# Altium project distribution amp.prjpcb
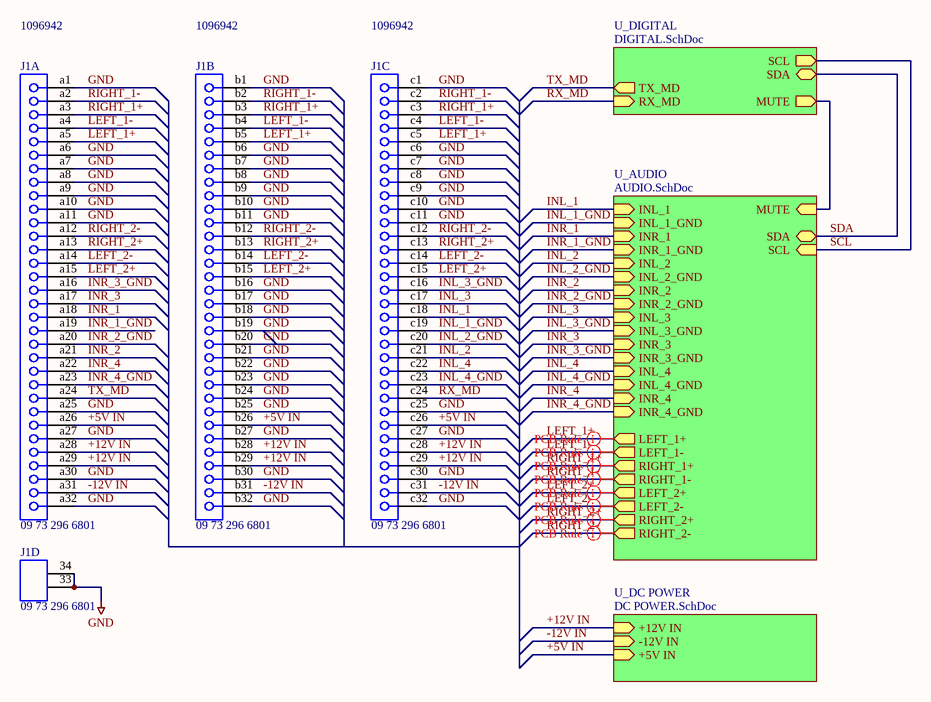
[diagram p0: Distribution Amp.SchDoc]
4 sheets, 136 parts. Net scope: hierarchical (ports join the sheet entries above them; power ports are global).
Board files: Distribution Amp (Seeed).PcbDoc, TDA1552 fix.PcbDoc
Sheets:
  Distribution Amp.SchDoc
    U_AUDIO = AUDIO.SchDoc
    U_DC POWER = DC POWER.SchDoc
    U_DIGITAL = DIGITAL.SchDoc

## Sheet Distribution Amp.SchDoc
size A3

### Parts
J1  09 73 296 6801  Supplier Part Number 3: 1096942  [0973296X801]  (parts A,B,C,D of 4)

### Sub-sheets
U_AUDIO = AUDIO.SchDoc: LEFT_1+ (out), LEFT_1- (out), RIGHT_1+ (out), RIGHT_1- (out), LEFT_2+ (out), LEFT_2- (out), RIGHT_2+ (out), RIGHT_2- (out), MUTE (in), INL_1 (in), INR_1 (in), INR_2 (in), INL_2 (in), INL_3 (in), INR_3 (in), INL_4 (in), INR_4 (in), SCL (in), SDA (bidir), INL_1_GND (in), INR_1_GND (in), INL_2_GND (in), INR_2_GND (in), INR_4_GND (in), INL_4_GND (in), INR_3_GND (in), INL_3_GND (in)
U_DC POWER = DC POWER.SchDoc: +12V IN (in), -12V IN (in), +5V IN (in)
U_DIGITAL = DIGITAL.SchDoc: SDA (bidir), SCL (out), MUTE (out), TX_MD (out), RX_MD (in)

### Nets
GND: J1.33(MH1) J1.34(MH2) J1.a1 J1.a6 J1.a7 J1.a8 J1.a9 J1.a10 J1.a11 J1.a25 J1.a27 J1.a30 J1.a32 J1.b1 J1.b6 J1.b7 J1.b8 J1.b9 J1.b10 J1.b11 J1.b16 J1.b17 J1.b18 J1.b19 J1.b20 J1.b21 J1.b22 J1.b23 J1.b24 J1.b25 J1.b27 J1.b30 J1.b32 J1.c1 J1.c6 J1.c7 J1.c8 J1.c9 J1.c10 J1.c11 J1.c25 J1.c27 J1.c30 J1.c32
+5V IN: J1.a26 J1.b26 J1.c26 ; sheet U_DC POWER/+5V IN
+12V IN: J1.a28 J1.a29 J1.b28 J1.b29 J1.c28 J1.c29 ; sheet U_DC POWER/+12V IN
-12V IN: J1.a31 J1.b31 J1.c31 ; sheet U_DC POWER/-12V IN
INL_1: J1.c18 ; sheet U_AUDIO/INL_1
INL_1_GND: J1.c19 ; sheet U_AUDIO/INL_1_GND
INL_2: J1.c21 ; sheet U_AUDIO/INL_2
INL_2_GND: J1.c20 ; sheet U_AUDIO/INL_2_GND
INL_3: J1.c17 ; sheet U_AUDIO/INL_3
INL_3_GND: J1.c16 ; sheet U_AUDIO/INL_3_GND
INL_4: J1.c22 ; sheet U_AUDIO/INL_4
INL_4_GND: J1.c23 ; sheet U_AUDIO/INL_4_GND
INR_1: J1.a18 ; sheet U_AUDIO/INR_1
INR_1_GND: J1.a19 ; sheet U_AUDIO/INR_1_GND
INR_2: J1.a21 ; sheet U_AUDIO/INR_2
INR_2_GND: J1.a20 ; sheet U_AUDIO/INR_2_GND
INR_3: J1.a17 ; sheet U_AUDIO/INR_3
INR_3_GND: J1.a16 ; sheet U_AUDIO/INR_3_GND
INR_4: J1.a22 ; sheet U_AUDIO/INR_4
INR_4_GND: J1.a23 ; sheet U_AUDIO/INR_4_GND
LEFT_1+: J1.a5 J1.b5 J1.c5 ; sheet U_AUDIO/LEFT_1+
LEFT_1-: J1.a4 J1.b4 J1.c4 ; sheet U_AUDIO/LEFT_1-
LEFT_2+: J1.a15 J1.b15 J1.c15 ; sheet U_AUDIO/LEFT_2+
LEFT_2-: J1.a14 J1.b14 J1.c14 ; sheet U_AUDIO/LEFT_2-
MUTE: sheet U_AUDIO/MUTE, sheet U_DIGITAL/MUTE
RIGHT_1+: J1.a3 J1.b3 J1.c3 ; sheet U_AUDIO/RIGHT_1+
RIGHT_1-: J1.a2 J1.b2 J1.c2 ; sheet U_AUDIO/RIGHT_1-
RIGHT_2+: J1.a13 J1.b13 J1.c13 ; sheet U_AUDIO/RIGHT_2+
RIGHT_2-: J1.a12 J1.b12 J1.c12 ; sheet U_AUDIO/RIGHT_2-
RX_MD: J1.c24 ; sheet U_DIGITAL/RX_MD
SCL: sheet U_AUDIO/SCL, sheet U_DIGITAL/SCL
SDA: sheet U_AUDIO/SDA, sheet U_DIGITAL/SDA
TX_MD: J1.a24 ; sheet U_DIGITAL/TX_MD

### Layout directives
rule Undefined; rule Width Constraint [Pref Width = 25mil    Min Width = 15mil    Max Width = 250mil]: LEFT_1+, LEFT_1-, LEFT_2+, LEFT_2-, RIGHT_1+, RIGHT_1-, RIGHT_2+, RIGHT_2-

### Library data of the parts
J1 = 09 73 296 6801: Eurocard DIN 41612, Type R, 96 Position, Rows a+b+c, Performance level 2, Female, Lead 3.0 mm, Pitch 2.54 mm; Manufacturer: HARTING; Manufacturer Part No.: 09732966801; Mouser Part no.: 617-09-73-296-6801; Value: 09732966801; Web link: http://au.mouser.com/ProductDetail/HARTING/09732966801/?qs=qa49y27LPCFbWAgQmjjqsljhIHhtEdU7BdVlYk8VXic%3d; Supplier 1: Mouser; Supplier Part Number 1: 617-09-73-296-6801; Supplier 2: Digi-Key; Supplier Part Number 2: 1195-2893-ND; Supplier 3: Farnell

## Sheet AUDIO.SchDoc
size A3
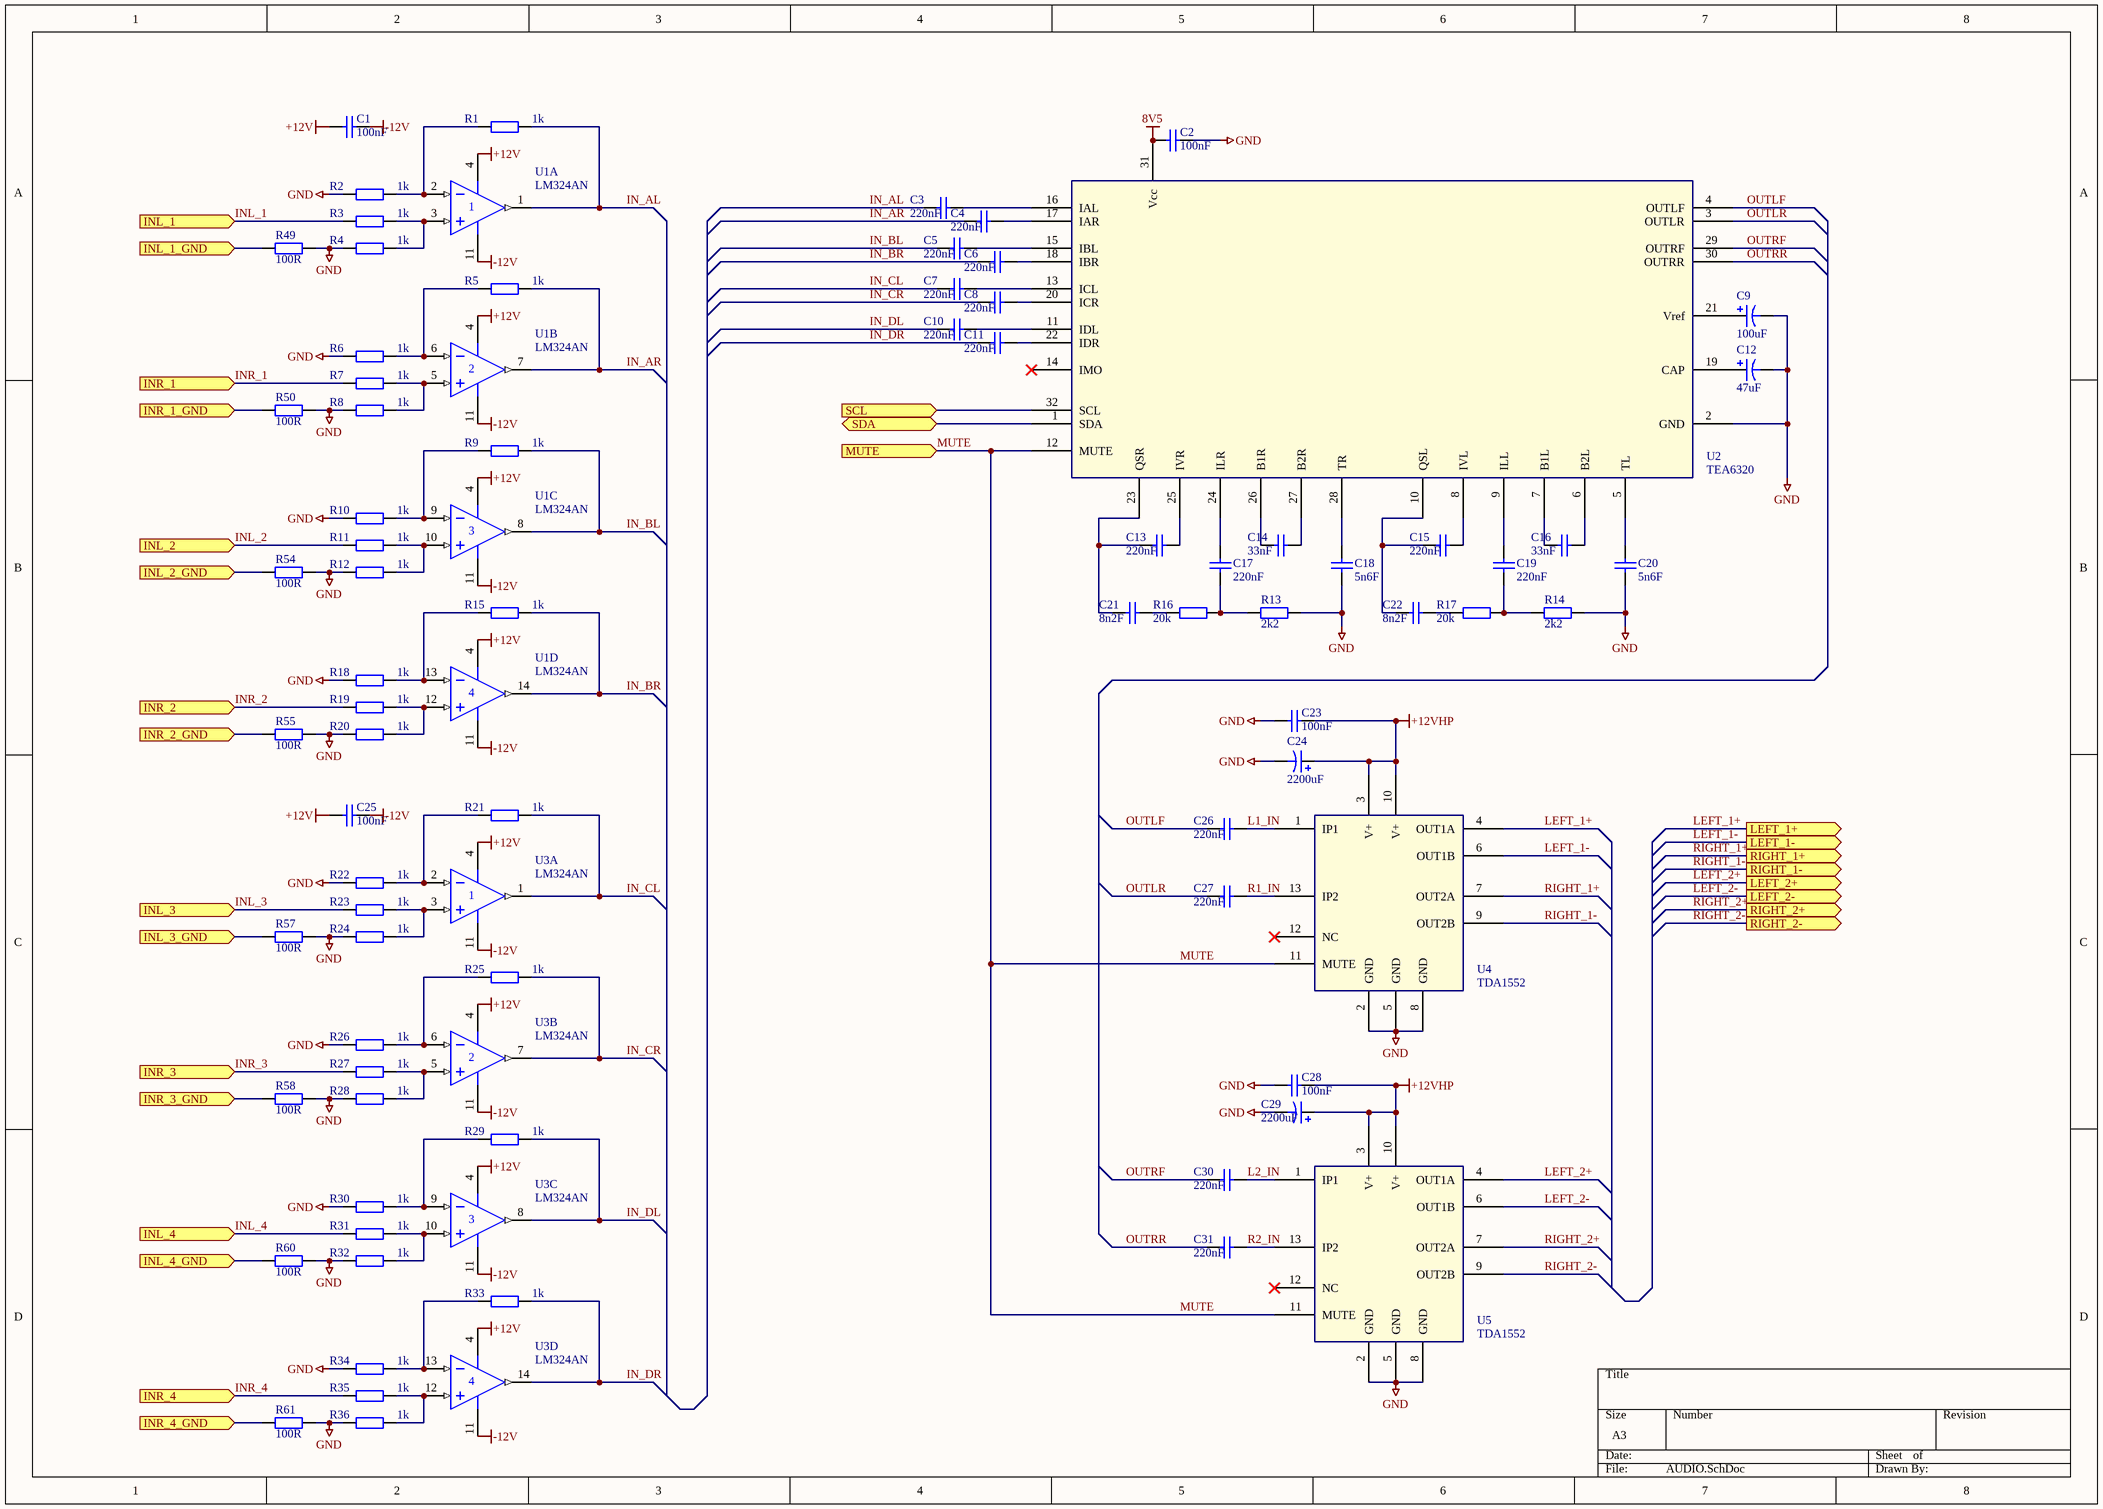
[diagram p1: AUDIO.SchDoc]

### Parts
C1  100nF  [CAP (3D) - 0603]
C2  100nF  [CAP (3D) - 0603]
C3  220nF  [CAP (3D) - 0603]
C4  220nF  [CAP (3D) - 0603]
C5  220nF  [CAP (3D) - 0603]
C6  220nF  [CAP (3D) - 0603]
C7  220nF  [CAP (3D) - 0603]
C8  220nF  [CAP (3D) - 0603]
C9  100uF  [CAPPR5-5x5]
C10  220nF  [CAP (3D) - 0603]
C11  220nF  [CAP (3D) - 0603]
C12  47uF  [CAPPR5-5x5]
C13  220nF  [CAP (3D) - 0603]
C14  33nF  [CAP (3D) - 0603]
C15  220nF  [CAP (3D) - 0603]
C16  33nF  [CAP (3D) - 0603]
C17  220nF  [CAP (3D) - 0603]
C18  5n6F  [CAP (3D) - 0603]
C19  220nF  [CAP (3D) - 0603]
C20  5n6F  [CAP (3D) - 0603]
C21  8n2F  [CAP (3D) - 0603]
C22  8n2F  [CAP (3D) - 0603]
C23  100nF  [CAP (3D) - 0603]
C24  2200uF  [CAPPR7.5-16x35]
C25  100nF  [CAP (3D) - 0603]
C26  220nF  [CAP (3D) - 0603]
C27  220nF  [CAP (3D) - 0603]
C28  100nF  [CAP (3D) - 0603]
C29  2200uF  [CAPPR7.5-16x35]
C30  220nF  [CAP (3D) - 0603]
C31  220nF  [CAP (3D) - 0603]
R1  1k  [RES (3D) - 0603]
R2  1k  [RES (3D) - 0603]
R3  1k  [RES (3D) - 0603]
R4  1k  [RES (3D) - 0603]
R5  1k  [RES (3D) - 0603]
R6  1k  [RES (3D) - 0603]
R7  1k  [RES (3D) - 0603]
R8  1k  [RES (3D) - 0603]
R9  1k  [RES (3D) - 0603]
R10  1k  [RES (3D) - 0603]
R11  1k  [RES (3D) - 0603]
R12  1k  [RES (3D) - 0603]
R13  2k2  [RES (3D) - 0603]
R14  2k2  [RES (3D) - 0603]
R15  1k  [RES (3D) - 0603]
R16  20k  [RES (3D) - 0603]
R17  20k  [RES (3D) - 0603]
R18  1k  [RES (3D) - 0603]
R19  1k  [RES (3D) - 0603]
R20  1k  [RES (3D) - 0603]
R21  1k  [RES (3D) - 0603]
R22  1k  [RES (3D) - 0603]
R23  1k  [RES (3D) - 0603]
R24  1k  [RES (3D) - 0603]
R25  1k  [RES (3D) - 0603]
R26  1k  [RES (3D) - 0603]
R27  1k  [RES (3D) - 0603]
R28  1k  [RES (3D) - 0603]
R29  1k  [RES (3D) - 0603]
R30  1k  [RES (3D) - 0603]
R31  1k  [RES (3D) - 0603]
R32  1k  [RES (3D) - 0603]
R33  1k  [RES (3D) - 0603]
R34  1k  [RES (3D) - 0603]
R35  1k  [RES (3D) - 0603]
R36  1k  [RES (3D) - 0603]
R49  100R  [RES (3D) - 0603]
R50  100R  [RES (3D) - 0603]
R54  100R  [RES (3D) - 0603]
R55  100R  [RES (3D) - 0603]
R57  100R  [RES (3D) - 0603]
R58  100R  [RES (3D) - 0603]
R60  100R  [RES (3D) - 0603]
R61  100R  [RES (3D) - 0603]
U1  LM324AN  [N014]  (parts A,B,C,D of 4)
U2  TEA6320  [SOIC127P1047-32L]
U3  LM324AN  [N014]  (parts A,B,C,D of 4)
U4  TDA1552  [DBS13P]
U5  TDA1552  [DBS13P]

### Ports
INL_1 (in), INL_1_GND (in), INL_2 (in), INL_2_GND (in), INL_3 (in), INL_3_GND (in), INL_4 (in), INL_4_GND (in), INR_1 (in), INR_1_GND (in), INR_2 (in), INR_2_GND (in), INR_3 (in), INR_3_GND (in), INR_4 (in), INR_4_GND (in), LEFT_1+ (out), LEFT_1- (out), LEFT_2+ (out), LEFT_2- (out), MUTE (in), RIGHT_1+ (out), RIGHT_1- (out), RIGHT_2+ (out), RIGHT_2- (out), SCL (in), SDA (bidir)

### Nets
8V5: C2.1 U2.31(Vcc)
+12V: C1.1 C25.1 U1.4(V+) U3.4(V+)
+12VHP: C23.2 C24.1 C28.2 C29.1 U4.3(V+) U4.10(V+) U5.3(V+) U5.10(V+)
-12V: C1.2 C25.2 U1.11(V-) U3.11(V-)
GND: C2.2 C9.2 C12.2 C18.2 C20.2 C23.1 C24.2 C28.1 C29.2 R2.1 R4.1 R6.1 R8.1 R10.1 R12.1 R13.2 R14.2 R18.1 R20.1 R22.1 R24.1 R26.1 R28.1 R30.1 R32.1 R34.1 R36.1 R49.2 R50.2 R54.2 R55.2 R57.2 R58.2 R60.2 R61.2 U2.2(GND) U4.2(GND) U4.5(GND) U4.8(GND) U5.2(GND) U5.5(GND) U5.8(GND)
IN_AL: C3.1 R1.2 U1.1(OUT)
IN_AR: C4.1 R5.2 U1.7(OUT)
IN_BL: C5.1 R9.2 U1.8(OUT)
IN_BR: C6.1 R15.2 U1.14(OUT)
IN_CL: C7.1 R21.2 U3.1(OUT)
IN_CR: C8.1 R25.2 U3.7(OUT)
IN_DL: C10.1 R29.2 U3.8(OUT)
IN_DR: C11.1 R33.2 U3.14(OUT)
INL_1: R3.1 ; port INL_1
INL_1_GND: R49.1 ; port INL_1_GND
INL_2: R11.1 ; port INL_2
INL_2_GND: R54.1 ; port INL_2_GND
INL_3: R23.1 ; port INL_3
INL_3_GND: R57.1 ; port INL_3_GND
INL_4: R31.1 ; port INL_4
INL_4_GND: R60.1 ; port INL_4_GND
INR_1: R7.1 ; port INR_1
INR_1_GND: R50.1 ; port INR_1_GND
INR_2: R19.1 ; port INR_2
INR_2_GND: R55.1 ; port INR_2_GND
INR_3: R27.1 ; port INR_3
INR_3_GND: R58.1 ; port INR_3_GND
INR_4: R35.1 ; port INR_4
INR_4_GND: R61.1 ; port INR_4_GND
L1_IN: C26.2 U4.1(IP1)
L2_IN: C30.2 U5.1(IP1)
LEFT_1+: U4.4(OUT1A) ; port LEFT_1+
LEFT_1-: U4.6(OUT1B) ; port LEFT_1-
LEFT_2+: U5.4(OUT1A) ; port LEFT_2+
LEFT_2-: U5.6(OUT1B) ; port LEFT_2-
MUTE: U2.12(MUTE) U4.11(MUTE) U5.11(MUTE) ; port MUTE
OUTLF: C26.1 U2.4(OUTLF)
OUTLR: C27.1 U2.3(OUTLR)
OUTRF: C30.1 U2.29(OUTRF)
OUTRR: C31.1 U2.30(OUTRR)
R1_IN: C27.2 U4.13(IP2)
R2_IN: C31.2 U5.13(IP2)
RIGHT_1+: U4.7(OUT2A) ; port RIGHT_1+
RIGHT_1-: U4.9(OUT2B) ; port RIGHT_1-
RIGHT_2+: U5.7(OUT2A) ; port RIGHT_2+
RIGHT_2-: U5.9(OUT2B) ; port RIGHT_2-
SCL: U2.32(SCL) ; port SCL
SDA: U2.1(SDA) ; port SDA
NetC3_2: C3.2 U2.16(IAL)
NetC4_2: C4.2 U2.17(IAR)
NetC5_2: C5.2 U2.15(IBL)
NetC6_2: C6.2 U2.18(IBR)
NetC7_2: C7.2 U2.13(ICL)
NetC8_2: C8.2 U2.20(ICR)
NetC9_1: C9.1 U2.21(Vref)
NetC10_2: C10.2 U2.11(IDL)
NetC11_2: C11.2 U2.22(IDR)
NetC12_1: C12.1 U2.19(CAP)
NetC13_1: C13.1 C21.1 U2.23(QSR)
NetC13_2: C13.2 U2.25(IVR)
NetC14_1: C14.1 U2.26(B1R)
NetC14_2: C14.2 U2.27(B2R)
NetC15_1: C15.1 C22.1 U2.10(QSL)
NetC15_2: C15.2 U2.8(IVL)
NetC16_1: C16.1 U2.7(B1L)
NetC16_2: C16.2 U2.6(B2L)
NetC17_1: C17.1 U2.24(ILR)
NetC17_2: C17.2 R13.1 R16.1
NetC18_1: C18.1 U2.28(TR)
NetC19_1: C19.1 U2.9(ILL)
NetC19_2: C19.2 R14.1 R17.1
NetC20_1: C20.1 U2.5(TL)
NetC21_2: C21.2 R16.2
NetC22_2: C22.2 R17.2
NetR1_1: R1.1 R2.2 U1.2(IN-)
NetR3_2: R3.2 R4.2 U1.3(IN+)
NetR5_1: R5.1 R6.2 U1.6(IN-)
NetR7_2: R7.2 R8.2 U1.5(IN+)
NetR9_1: R9.1 R10.2 U1.9(IN-)
NetR11_2: R11.2 R12.2 U1.10(IN+)
NetR15_1: R15.1 R18.2 U1.13(IN-)
NetR19_2: R19.2 R20.2 U1.12(IN+)
NetR21_1: R21.1 R22.2 U3.2(IN-)
NetR23_2: R23.2 R24.2 U3.3(IN+)
NetR25_1: R25.1 R26.2 U3.6(IN-)
NetR27_2: R27.2 R28.2 U3.5(IN+)
NetR29_1: R29.1 R30.2 U3.9(IN-)
NetR31_2: R31.2 R32.2 U3.10(IN+)
NetR33_1: R33.1 R34.2 U3.13(IN-)
NetR35_2: R35.2 R36.2 U3.12(IN+)

Not connected (* = marked no-connect by the designer): U2 14(IMO)*; U4 12(NC)*; U5 12(NC)*

### Library data of the parts
C1 C2 C23 C25 C28 = Cap: Capacitor; Manufacturer: YAEGO; Manufacturer Part No.: CC0603ZRY5V9BB104; Value: 100nF; Mouser Part no.: 603-C0603ZRY5V9BB104; Web link: http://au.mouser.com/ProductDetail/Yageo/CC0603ZRY5V9BB104/?qs=AgBp2OyFlx%252bk1xe0tOfw5lSGBXIDidlPHbEeepmuVSw%3d; Supplier 1: Mouser; Supplier Part Number 1: 603-C0603ZRY5V9BB104; Supplier 2: Digi-Key; Supplier Part Number 2: 311-1343-2-ND
C3-C8 C10 C11 C13 C15 C17 C19 C26 C27 C30 C31 = Cap: Capacitor; Manufacturer: YAGEO; Manufacturer Part No.: CC0603KRX7R6BB224; Value: 220nF; Mouser Part no.: 603-CC603KRX7R6BB224; Web link: http://au.mouser.com/ProductDetail/Yageo/CC0603KRX7R6BB224/?qs=AgBp2OyFlx832aJNQIgpgiHcXe6SP9wJA8622nI5Qdc%3d; Supplier 1: Mouser; Supplier 2: Digi-Key; Supplier Part Number 1: 810-C1608X7R1E224K; Supplier Part Number 2: 445-5191-1-ND
C9 = Cap Pol1: Polarized Capacitor (Radial); Manufacturer: EPCOS; Manufacturer Part No.: B41828A7107M7; Value: 100uF; Mouser Part No.: 871-B41828A7107M7; Web Link: http://au.mouser.com/ProductDetail/EPCOS/B41828A7107M7/?qs=nVvxX1UUhUykfM7qFE3BRbEQLHdHrVYrVo8dT3SN8Ro%3d; Supplier 1: Mouser; Supplier Part Number 1: 667-EEU-FR1E101; Supplier 2: Digi-Key; Supplier Part Number 2: P5152-ND
C12 = Cap Pol1: Polarized Capacitor (Radial); Manufacturer: EPCOS; Manufacturer Part No.: B41821A7476M000; Value: 47uF; Mouser Part No.: 871-B41821A7476M000; Web Link: http://au.mouser.com/ProductDetail/EPCOS/B41821A7476M000/?qs=DFkWJ3l%252bHdIv7z5oK21FR7vsdrlTw8IhmVcyMZVp3lA%3d; Supplier 1: Mouser; Supplier Part Number 1: 667-EEU-FR1E470; Supplier 2: Digi-Key; Supplier Part Number 2: P15360CT-ND
C14 C16 = Cap: Capacitor; Manufacturer: VISHAY; Manufacturer Part No.: VJ0603Y333KXACW1BC; Value: 33nF; Mouser Part No.: 77-VJ0603Y333KXACBC; Web Link: http://au.mouser.com/ProductDetail/Vishay-Vitramon/VJ0603Y333KXACW1BC/?qs=luzi6J3HciVz2jbLrp0fISmEIlUx13SmksE8B%2fo8iFo%3d; Supplier 1: Mouser; Supplier Part Number 1: 810-CGJ3E2X7R1C333K; Supplier 2: Digi-Key; Supplier Part Number 2: 445-5093-1-ND
C18 C20 = Cap: Capacitor; Manufacturer: YAEGO; Manufacturer Part No.: CC0603KRX7R9BB562; Value: 5n6F; Mouser Part No.: 603-CC603KRX7R9BB562; Web Link: http://au.mouser.com/ProductDetail/Yageo/CC0603KRX7R9BB562/?qs=AgBp2OyFlx%2fpnRyz2d1BOV0w2oSYtKHWEBmm9y5urok%3d; Supplier 1: Mouser; Supplier Part Number 1: 77-VJ0603Y562KXAPBC; Supplier 2: Digi-Key; Supplier Part Number 2: 445-2666-1-ND
C21 C22 = Cap: Capacitor; Manufacturer: VISHAY; Manufacturer Part No.: VJ0603Y822KXACW1BC; Value: 8n2F; Mouser Part No.: 77-VJ0603Y822KXACBC; Web Link: http://au.mouser.com/ProductDetail/Vishay-Vitramon/VJ0603Y822KXACW1BC/?qs=ZwrkFVw2o8%2ft%252b373yGtNl93PhR3QyA%252bD6uaH33kGuhU%3d; Supplier 1: Mouser; Supplier 2: Digi-Key; Supplier Part Number 1: 81-GRM18R71E822KA01D; Supplier Part Number 2: 445-2668-6-ND
C24 C29 = Cap Pol1: Polarized Capacitor (Radial); Manufacturer: Lelon; Manufacturer Part No.: RGA222M1EBK-1625P; Value: 2200uF; Mouser Part No.: 140-RGA222M1EBK1625P; Web Link: http://au.mouser.com/ProductDetail/Lelon/RGA222M1EBK-1625P/?qs=LVGG2qFPDbHSw2xJTgLljXX%252bpY7%2f7oyC%252beiZpKBfNsE%3d; Supplier 1: Mouser; Supplier 2: Digi-Key; Supplier Part Number 1: 80-ESK228M025AL4AA; Supplier Part Number 2: 399-6110-ND
R1-R12 R15 R18-R36 = Res2: Resistor; Manufacturer: YAEGO; Manufacturer Part No.: AC0603FR-071KL; Value: 1k; Mouser Part No.: 603-AC0603FR-071KL; Web Link: http://au.mouser.com/ProductDetail/Yageo/AC0603FR-071KL/?qs=UoPT7wUmgYKxwZ%2f8fbV6CGhBt%252bA%252b5EDe; Supplier 1: Mouser; Supplier 2: Digi-Key; Supplier Part Number 1: 603-AC0603FR-071KL; Supplier Part Number 2: 311-1KLDCT-ND
R13 R14 = Res2: Resistor; Manufacturer: YAEGO; Manufacturer Part No.: RC0603JR-072K2L; Value: 2k2; Mouser Part No.: 603-RC0603JR-072K2L; Web Link: http://au.mouser.com/ProductDetail/Yageo/RC0603JR-072K2L/?qs=%2f9ZTgpVJnN6NiG8%2fhy1UYdm%2fIZ4uAodTTlsfuu9%2fRBA%3d; Supplier 1: Mouser; Supplier 2: Digi-Key; Supplier Part Number 1: 71-CRCW0603J-2.2K-E3; Supplier Part Number 2: RMCF0603JT2K20CT-ND
R16 R17 = Res2: Resistor; Manufacturer: XICON; Manufacturer Part No.: 302-20K-RC; Value: 20k; Mouser Part No.: 302-20K-RC; Web Link: http://au.mouser.com/ProductDetail/Xicon/302-20K-RC/?qs=QiHmIYCRcHpC334pZQQGxw1aK3emtO7wZTvJ4LdbZl8%3d; Supplier 1: Mouser; Supplier 2: Digi-Key; Supplier Part Number 1: 652-CR0603JW-203ELF; Supplier Part Number 2: P20KGCT-ND
R49 R50 R54 R55 R57 R58 R60 R61 = Res2: Resistor; Manufacturer: YAEGO; Manufacturer Part No.: RC0603FR-07100RL; Value: 100R; Mouser Part No.: 603-RC0603FR-07100RL; Web Link: http://au.mouser.com/ProductDetail/Yageo/RC0603FR-07100RL/?qs=NEN%2fsE%2fLsvNZmJsqhL3QSPml4gnL9OhHteu5IxNdzn8%3d; Supplier 1: Mouser; Supplier Part Number 1: 302-100-RC; Supplier 2: Digi-Key; Supplier Part Number 2: RMCF0603JT100RCT-ND
U1 U3 = LM324AN: Quadruple Operational Amplifier; Manufacturer: ST MICRO; Value: LM324; Manufacturer Part No.: LM324AN; Mouser Part No.: 511-LM324AN; Web Link: http://au.mouser.com/ProductDetail/STMicroelectronics/LM324AN/?qs=Aez0sHNrW%2fUytSAnJAKyV%252b8BIEGXhIFhom0MkRvP3bs%3d; Supplier 1: Mouser; Supplier Part Number 1: 595-LM324AN; Supplier 2: Digi-Key; Supplier Part Number 2: 497-1579-5-ND
U2 = TEA6320: TEA6320 SOUND FADER CONTROL; Manufacturer: NXP SEMICONDUCTOR; Manufacturer Part No.: TEA6320T/V1,518; Mouser Part No.: 771-TEA6320TD-T; Web Link: http://au.mouser.com/ProductDetail/NXP-Semiconductors/TEA6320T-V1518/?qs=LOCUfHb8d9uVFMOgY9aWifj9j3JlMzQOD29BrXWviGU%3d; Value: TEA6320
U4 U5 = TDA1552: Manufacturer: NXP SEMICONDUCTOR; Manufacturer Part No.: TDA1552Q/N4,112; Mouser Part No.: 771-TDA1552QU; Web Link: http://au.mouser.com/ProductDetail/NXP/TDA1552Q-N4112/?qs=LOCUfHb8d9vIWlct8ea52g%3d%3d; Value: TDA1552

## Sheet DC POWER.SchDoc
size A4
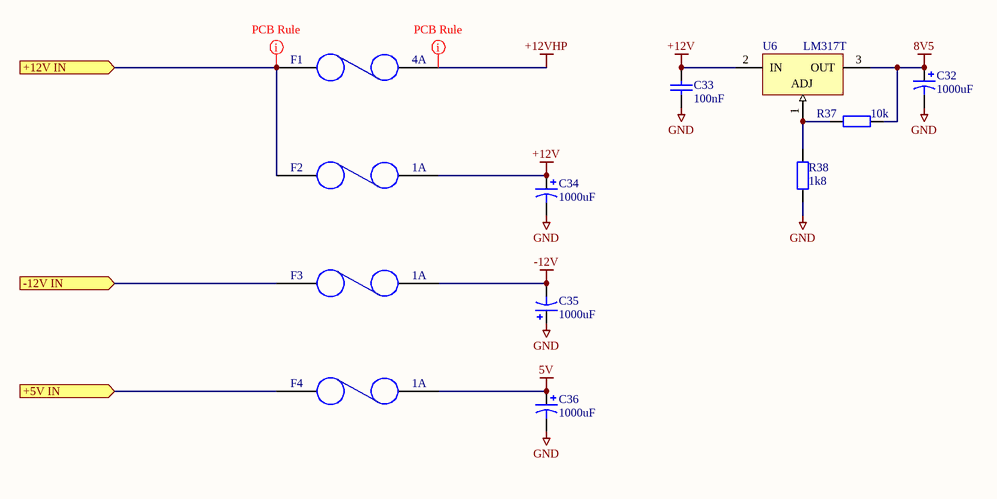
[diagram p2: DC POWER.SchDoc]

### Parts
C32  1000uF  [CAPPR5-5x5]
C33  100nF  [CAP (3D) - 0603]
C34  1000uF  [CAPPR5-5x5]
C35  1000uF  [CAPPR5-5x5]
C36  1000uF  [CAPPR5-5x5]
F1  4A  [POLYSWITCH]
F2  1A  [3216[1206]]
F3  1A  [3216[1206]]
F4  1A  [3216[1206]]
R37  10k  [RES (3D) - 0603]
R38  1k8  [RES (3D) - 0603]
U6  LM317T  [TO220ABN]

### Ports
+5V IN (in), +12V IN (in), -12V IN (in)

### Nets
5V: C36.1 F4.2
8V5: C32.1 R37.2 U6.3(OUT)
+12V: C33.2 C34.1 F2.2 U6.2(IN)
+12VHP: F1.2
-12V: C35.2 F3.2
GND: C32.2 C33.1 C34.2 C35.1 C36.2 R38.1
+5V IN: F4.1 ; port +5V IN
+12V IN: F1.1 F2.1 ; port +12V IN
-12V IN: F3.1 ; port -12V IN
NetR37_1: R37.1 R38.2 U6.1(ADJ)

### Layout directives
rule Width Constraint [Pref Width = 50mil    Min Width = 15mil    Max Width = 250mil]: +12VHP
rule Width Constraint [Pref Width = 50mil    Min Width = 50mil    Max Width = 250mil]: +12V IN

### Library data of the parts
C32 C34-C36 = Cap Pol1: as C9 on sheet AUDIO; Value: 1000uF; Mouser Part No.: 871-B41828A7107M7; Web Link: http://au.mouser.com/ProductDetail/EPCOS/B41828A7107M7/?qs=nVvxX1UUhUykfM7qFE3BRbEQLHdHrVYrVo8dT3SN8Ro%3d; Supplier 1: Mouser; Supplier 2: Digi-Key; Supplier Part Number 1: 667-ECA-1VM102; Supplier Part Number 2: P5169-ND
C33 = Cap: as C1 on sheet AUDIO; Value: 100nF; Mouser Part no.: 603-C0603ZRY5V9BB104; Web link: http://au.mouser.com/ProductDetail/Yageo/CC0603ZRY5V9BB104/?qs=AgBp2OyFlx%252bk1xe0tOfw5lSGBXIDidlPHbEeepmuVSw%3d; Supplier 1: Mouser; Supplier 2: Digi-Key; Supplier Part Number 1: 603-C0603ZRY5V9BB104; Supplier Part Number 2: 311-1343-2-ND
F1 = FUSE ALTRONICS S5985: Manufacturer: TE CONNECTIVITY / RAYCHEM; Manufacturer Part No.: RUEF400-2; Element 14: 2078397; Mouser Part No.: 650-RUEF400-2; Web Link: http://au.mouser.com/ProductDetail/TE-Connectivity/RUEF400-2/?qs=hv6pn79dJPRrKKJp8fmA6A%3d%3d; Value: 4A; Supplier 1: Mouser; Supplier Part Number 1: 650-RUEF400-2; Supplier 2: Digi-Key; Supplier Part Number 2: RGEF400-ND
F2-F4 = FUSE ALTRONICS S5985: Manufacturer: TE CONNECTIVITY / RAYCHEM; Manufacturer Part No.: NANOSMDC110F-2; Element 14: 1861192; Mouser Part No.: 650-NANOSMDC110F-2; Web Link: http://au.mouser.com/ProductDetail/TE-Connectivity-Raychem/NANOSMDC110F-2/?qs=F6FIpiMdEVaqi0EOwT5ZJqOYTKi36iabKDMkTKOaCbU%3d; Value: 1A; Supplier 1: Mouser; Supplier Part Number 1: 650-NANOSMDC110F-2; Supplier 2: Digi-Key; Supplier Part Number 2: NANOSMDC110FDKR-ND
R37 = Res2: Resistor; Manufacturer: YAEGO; Manufacturer Part No.: AC0603JR-0710KL; Value: 10k; Mouser Part No.: 603-AC0603JR-0710KL; Web Link: http://au.mouser.com/ProductDetail/Yageo/AC0603JR-0710KL/?qs=cGU37fGUGy%2ffTpJnc0hqwyfRqkqml5N9cIWubNc1%2ffQ%3d; Supplier 1: Mouser; Supplier 2: Digi-Key; Supplier Part Number 1: 603-AC0603JR-0710KL; Supplier Part Number 2: 311-10KLECT-ND
R38 = Res2: Resistor; Manufacturer: YAEGO; Manufacturer Part No.: AC0603FR-071K8L; Value: 1k8; Mouser Part No.: 603-AC0603FR-071K8L; Web Link: http://au.mouser.com/ProductDetail/Yageo/AC0603FR-071K8L/?qs=UoPT7wUmgYI8kG5vasY4GgTvioKlpjIzfCXXRT03z8Q%3d; Supplier 1: Mouser; Supplier Part Number 1: 71-CRCW02011K80FKED; Supplier 2: Digi-Key; Supplier Part Number 2: 311-1.80KHRDKR-ND
U6 = LM317T: 1.2V to 37V Voltage Regulator; Manufacturer: ON SEMI; Manufacturer Part No.: LM317TG; Mouser Part No.: 863-LM317TG; Web Link: http://au.mouser.com/ProductDetail/ON-Semiconductor/LM317TG/?qs=2OtswVQKCOFn%2fwibROB6tiGLs9boMjQbWXUBNe5sOqI%3d; Supplier 1: Mouser; Supplier Part Number 1: 863-LM317TG; Supplier 2: Digi-Key; Supplier Part Number 2: 497-1575-5-ND

## Sheet DIGITAL.SchDoc
size A3
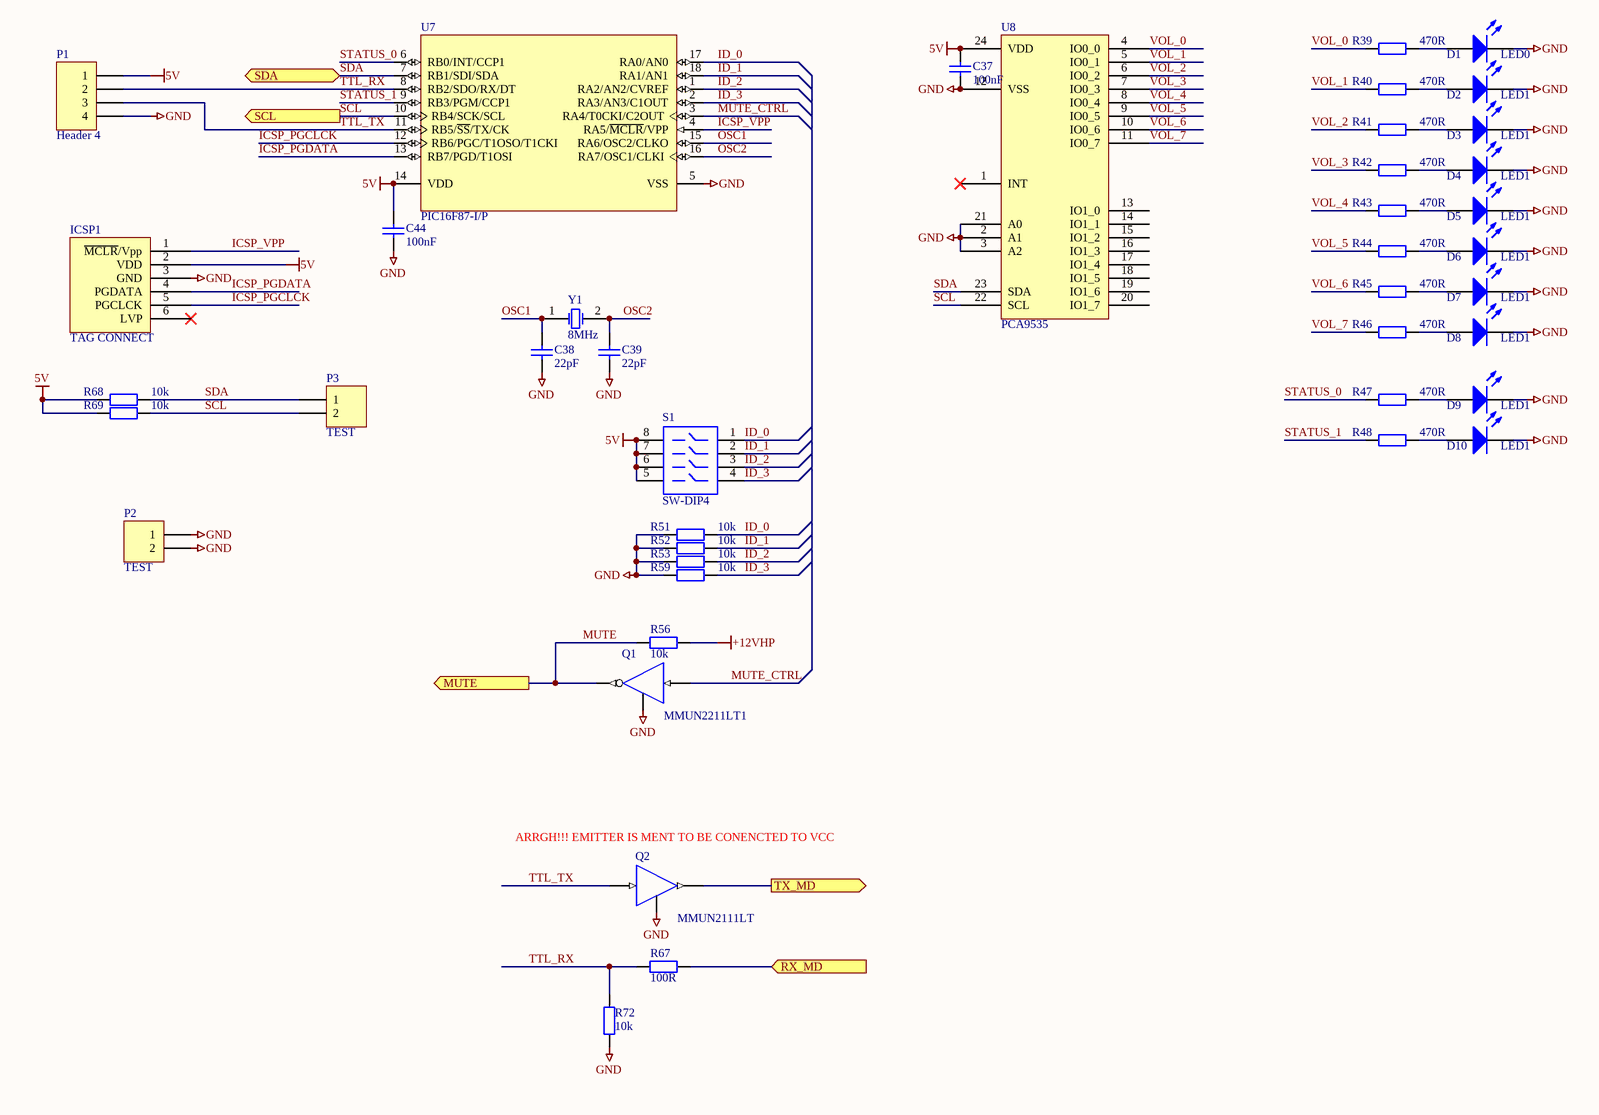
[diagram p3: DIGITAL.SchDoc]

### Parts
C37  100nF  [CAP (3D) - 0603]
C38  22pF  [CAP (3D) - 0603]
C39  22pF  [CAP (3D) - 0603]
C44  100nF  [CAP (3D) - 0603]
D1  LED0  [LED 3MM]
D2  LED1  [LED 3MM]
D3  LED1  [LED 3MM]
D4  LED1  [LED 3MM]
D5  LED1  [LED 3MM]
D6  LED1  [LED 3MM]
D7  LED1  [LED 3MM]
D8  LED1  [LED 3MM]
D9  LED1  [LED 3MM]
D10  LED1  [LED 3MM]
ICSP1  TAG CONNECT  [ICSP - TAG CONNECT TYPE2]
P1  Header 4  [HDR1X4]
P2  TEST  [HDR1X2]
P3  TEST  [HDR1X2]
Q1  MMUN2211LT1  [SOT23-3L]
Q2  MMUN2111LT  [SOT23-3L]
R39  470R  [RES (3D) - 0603]
R40  470R  [RES (3D) - 0603]
R41  470R  [RES (3D) - 0603]
R42  470R  [RES (3D) - 0603]
R43  470R  [RES (3D) - 0603]
R44  470R  [RES (3D) - 0603]
R45  470R  [RES (3D) - 0603]
R46  470R  [RES (3D) - 0603]
R47  470R  [RES (3D) - 0603]
R48  470R  [RES (3D) - 0603]
R51  10k  [RES (3D) - 0603]
R52  10k  [RES (3D) - 0603]
R53  10k  [RES (3D) - 0603]
R56  10k  [RES (3D) - 0603]
R59  10k  [RES (3D) - 0603]
R67  100R  [RES (3D) - 0603]
R68  10k  [RES (3D) - 0603]
R69  10k  [RES (3D) - 0603]
R72  10k  [RES (3D) - 0603]
S1  SW-DIP4  [DIP-8]  (no BOM)
U7  PIC16F87-I/P  [PDIP300-18]
U8  PCA9535  [WSO24_L]
Y1  8MHz  [HC-49U]

### Ports
MUTE (out), RX_MD (in), SCL (out), SDA (bidir), TX_MD (out)

### Nets
5V: C37.2 C44.2 ICSP1.2(VDD) P1.1 R68.1 R69.1 S1.5 S1.6 S1.7 S1.8 U7.14(VDD) U8.24(VDD)
+12VHP: R56.1
GND: C37.1 C38.1 C39.1 C44.1 D1.2(K) D2.2(K) D3.2(K) D4.2(K) D5.2(K) D6.2(K) D7.2(K) D8.2(K) D9.2(K) D10.2(K) ICSP1.3(GND) P1.4 P2.1 P2.2 Q1.2(E) Q2.2(E) R51.1 R52.1 R53.1 R59.1 R72.1 U7.5(VSS) U8.2(A1) U8.3(A2) U8.12(VSS) U8.21(A0)
ICSP_PGCLCK: ICSP1.5(PGCLCK) U7.12(RB6/PGC/T1OSO/T1CKI)
ICSP_PGDATA: ICSP1.4(PGDATA) U7.13(RB7/PGD/T1OSI)
ICSP_VPP: ICSP1.1(~{MCLR}/Vpp) U7.4(RA5/~{MCLR}/VPP)
ID_0: R51.2 S1.1 U7.17(RA0/AN0)
ID_1: R52.2 S1.2 U7.18(RA1/AN1)
ID_2: R53.2 S1.3 U7.1(RA2/AN2/CVREF)
ID_3: R59.2 S1.4 U7.2(RA3/AN3/C1OUT)
MUTE: Q1.3(C) R56.2 ; port MUTE
MUTE_CTRL: Q1.1(B) U7.3(RA4/T0CKI/C2OUT)
OSC1: C38.2 U7.15(RA6/OSC2/CLKO) Y1.1(OSC1)
OSC2: C39.2 U7.16(RA7/OSC1/CLKI) Y1.2(OSC2)
RX_MD: R67.2 ; port RX_MD
SCL: P3.2 R69.2 U7.10(RB4/SCK/SCL) U8.22(SCL) ; port SCL
SDA: P3.1 R68.2 U7.7(RB1/SDI/SDA) U8.23(SDA) ; port SDA
STATUS_0: R47.1 U7.6(RB0/INT/CCP1)
STATUS_1: R48.1 U7.9(RB3/PGM/CCP1)
TTL_RX: P1.2 R67.1 R72.2 U7.8(RB2/SDO/RX/DT)
TTL_TX: P1.3 Q2.1(B) U7.11(RB5/~{SS}/TX/CK)
TX_MD: Q2.3(C) ; port TX_MD
VOL_0: R39.1 U8.4(IO0_0)
VOL_1: R40.1 U8.5(IO0_1)
VOL_2: R41.1 U8.6(IO0_2)
VOL_3: R42.1 U8.7(IO0_3)
VOL_4: R43.1 U8.8(IO0_4)
VOL_5: R44.1 U8.9(IO0_5)
VOL_6: R45.1 U8.10(IO0_6)
VOL_7: R46.1 U8.11(IO0_7)
NetD1_1: D1.1(A) R39.2
NetD2_1: D2.1(A) R40.2
NetD3_1: D3.1(A) R41.2
NetD4_1: D4.1(A) R42.2
NetD5_1: D5.1(A) R43.2
NetD6_1: D6.1(A) R44.2
NetD7_1: D7.1(A) R45.2
NetD8_1: D8.1(A) R46.2
NetD9_1: D9.1(A) R47.2
NetD10_1: D10.1(A) R48.2

Not connected (* = marked no-connect by the designer): ICSP1 6(LVP)*; U8 1(INT)* 13(IO1_0) 14(IO1_1) 15(IO1_2) 16(IO1_3) 17(IO1_4) 18(IO1_5) 19(IO1_6) 20(IO1_7)

### Notes on the sheet
- (near Q2) ARRGH!!! EMITTER IS MENT TO BE CONENCTED TO VCC

### Library data of the parts
C37 C44 = Cap: as C1 on sheet AUDIO; Value: 100nF; Mouser Part no.: 603-C0603ZRY5V9BB104; Web link: http://au.mouser.com/ProductDetail/Yageo/CC0603ZRY5V9BB104/?qs=AgBp2OyFlx%252bk1xe0tOfw5lSGBXIDidlPHbEeepmuVSw%3d; Supplier 1: Mouser; Supplier 2: Digi-Key; Supplier Part Number 1: 603-C0603ZRY5V9BB104; Supplier Part Number 2: 311-1343-2-ND
C38 C39 = Cap: Capacitor; Manufacturer: XICON; Manufacturer Part No.: 140-CC504N220J-RC; Value: 22pF; Mouser Part No.: 140-CC504N220J-RC; Web Link: http://au.mouser.com/ProductDetail/Xicon/140-CC504N220J-RC/?qs=0ZUpllj3bsYzruu%2fcoq7vTMVNT1WtLd%2fpuK8loL2Z54%3d; Supplier 1: Mouser; Supplier Part Number 1: 810-CGA3E2C0G1H220J; Supplier 2: Digi-Key; Supplier Part Number 2: 445-4659-1-ND
D1 = LED0: Typical INFRARED GaAs LED; Manufacturer: VISHAY; Manufacturer Part No.: TLUR4401; Value: 5mm RED; Mouser Part No.: 78-TLUR4401; Web Link: http://au.mouser.com/ProductDetail/Vishay-Semiconductors/TLUR4401/?qs=wPfJvkPQFIx0FPogkG3Rk17kK5izA6tzHCIdzMGswXQ%3d
D2 = LED1: Typical RED GaAs LED; Manufacturer: VISHAY; Manufacturer Part No.: TLHE4600; Value: 5mm Yellow; Mouser Part No.: 78-TLHE4600; Web Link: http://au.mouser.com/ProductDetail/Vishay-Semiconductors/TLHE4600/?qs=%2fjqivxn91cfR0QvyUZMNU9A%2fAGcwtLVHZCHJgVoNs1k%3d
D3-D8 = LED1: Typical RED GaAs LED; Manufacturer: VISHAY; Manufacturer Part No.: TLHG4405; Value: 5mm GREEN; Mouser Part No.: 78-TLHG4405; Web Link: http://au.mouser.com/ProductDetail/Vishay-Semiconductors/TLHG4405/?qs=%2fjqivxn91ceXQHLEqPKOGEAVX9AVRiAwFz0xjELkLgQ%3d
D9 D10 = LED1: Typical RED GaAs LED; Manufacturer: VISHAY; Manufacturer Part No.: TLHB4400; Value: 5mm BLUE; Mouser Part No.: 78-TLHB4400; Web Link: http://au.mouser.com/ProductDetail/Vishay-Semiconductors/TLHB4400/?qs=Ymhh3MYumTk3eLVnr%2fL8z9qvLxshKLWmjpIB0Dh4Pzg%3d
ICSP1 = ICSP - TAG CONNECT: Manufacturer: N/A - PCB ARTWORK; Manufacturer Part No.: N/A; Mouser Part no.: N/A; Web link: N/A - PCB ARTWORK
P1 = Header 4: Header, 4-Pin; Manufacturer: NA PCB ARTWORK; Manufacturer Part No.: NA PCB ARTWORK; Mouser Part No.: NA PCB ARTWORK; Web Link: NA PCB ARTWORK
P2 P3 = Header 2: Header, 2-Pin; Manufacturer: NA PCB ARTWORK; value: NA PCB ARTWORK; Manufacturer Part No.: NA PCB ARTWORK; Mouser Part no.: NA PCB ARTWORK; Web link: NA PCB ARTWORK
Q1 = NPN DIGITAL TRANSISTOR: Manufacturer: ON SEMO; Manufacturer Part No.: MMUN2211LT1G; Mouser Part no.: 863-MMUN2211LT1G; Web link: http://au.mouser.com/ProductDetail/ON-Semiconductor/MMUN2211LT1G/?qs=ZpPixqFcBtyOBGnml%2fmJx1k1aPkM%252ba71PMQX%2fEUGWkQ%3d; value: MMUN2211; Supplier 1: Mouser; Supplier Part Number 1: 863-MMUN2211LT1G; Supplier 2: Digi-Key; Supplier Part Number 2: MMUN2211LT1GOSCT-ND
Q2 = PNP DIGITAL TRANSISTOR: MMUN2111LT1; Manufacturer: ON SEMI; Manufacturer Part No.: MMUN2111LT1G; Mouser Part no.: 863-MMUN2111LT1G; Web link: http://au.mouser.com/ProductDetail/ON-Semiconductor/MMUN2111LT1G/?qs=ZpPixqFcBtwQDxXftSY18HVoUlEOKOEv; value: MMUN2111; Supplier 1: Mouser; Supplier Part Number 1: 863-MMUN2111LT1G; Supplier 2: Digi-Key; Supplier Part Number 2: MMUN2111LT1GOSCT-ND
R39-R48 = Res2: Resistor; Manufacturer: YAEGO; Manufacturer Part No.: AC0603FR-07470RL; Value: 470R; Mouser Part No.: 603-AC0603FR-07470RL; Web Link: http://au.mouser.com/ProductDetail/Yageo/AC0603FR-07470RL/?qs=UoPT7wUmgYJ4U%252bu075ZTYP6sVL%2fdvPe6mRJ9iCUfaf8%3d; Supplier 1: Mouser; Supplier Part Number 1: 301-470-RC; Supplier 2: Digi-Key; Supplier Part Number 2: 311-470GRCT-ND
R51-R53 R56 R59 R68 R69 R72 = Res2: as R37 on sheet DC POWER; Value: 10k; Mouser Part No.: 603-AC0603JR-0710KL; Web Link: http://au.mouser.com/ProductDetail/Yageo/AC0603JR-0710KL/?qs=cGU37fGUGy%2ffTpJnc0hqwyfRqkqml5N9cIWubNc1%2ffQ%3d; Supplier 1: Mouser; Supplier 2: Digi-Key; Supplier Part Number 1: 603-AC0603JR-0710KL; Supplier Part Number 2: 311-10KLECT-ND
R67 = Res2: as R49 on sheet AUDIO; Value: 100R; Mouser Part No.: 603-RC0603FR-07100RL; Web Link: http://au.mouser.com/ProductDetail/Yageo/RC0603FR-07100RL/?qs=NEN%2fsE%2fLsvNZmJsqhL3QSPml4gnL9OhHteu5IxNdzn8%3d; Supplier 1: Mouser; Supplier 2: Digi-Key; Supplier Part Number 1: 302-100-RC; Supplier Part Number 2: RMCF0603JT100RCT-ND
S1 = SW-DIP4: DIP Switch; Manufacturer: NA PCB ARTWORK; Manufacturer Part No.: NA PCB ARTWORK; Mouser Part No.: NA PCB ARTWORK; Web Link: NA PCB ARTWORK
U7 = PIC16F87-I/P: Enhanced FLASH Microcontroller with nanoWatt Technology, 4K (x14-Bit words) FLASH, 368 Bytes RAM, 18-Pin PDIP, Standard VDD Range, Industrial Temperature; Manufacturer: MICROCHIP; Manufacturer Part No.: PIC16F87-I/P; Mouser Part No.: 579-PIC16F87-I/P; Web Link: http://au.mouser.com/ProductDetail/Microchip/PIC16F87-I-P/?qs=lQv0JY93vreTeOWEyXwAMw%3d%3d; Supplier 1: Mouser; Supplier Part Number 1: 579-PIC16F87-I/P; Supplier 2: Digi-Key; Supplier Part Number 2: PIC16F87-I/P-ND
U8 = PCA9535: PCA9535 I2C BUS 16 BIT IO EXPANDER; Manufacturer: NXP Semiconductors; Manufacturer Part No.: PCA9535D,112; value: PCA9535D,112; Mouser Part no.: 771-PCA9535D112; Web link: http://au.mouser.com/ProductDetail/NXP-Semiconductors/PCA9535D112/?qs=sGAEpiMZZMutXGli8Ay4kAfwW/5bhnYT8yEKTPxoZ0k%3d; Supplier 1: Mouser; Supplier Part Number 1: 771-PCA9535D112; Supplier 2: Digi-Key; Supplier Part Number 2: 568-8708-6-ND
Y1 = XTAL: Crystal Oscillator; Manufacturer: CTS Electronic Components; Manufacturer Part No.: ATS080B; Mouser Part No.: 774-ATS080B; Web Link: http://au.mouser.com/ProductDetail/CTS-Electronic-Components/ATS080B/?qs=EyvxYzk7Sd2aTvRJmqPlOIqSHD%252bMQgdc; Value: 8MHz; Supplier 1: Mouser; Supplier Part Number 1: 774-ATS080B; Supplier 2: Digi-Key; Supplier Part Number 2: CTX900-ND

## Nets that join several sheets
5V: DC POWER (C36.1 F4.2), DIGITAL (12 pins)
8V5: AUDIO (C2.1 U2.31), DC POWER (C32.1 R37.2 U6.3)
+12V: AUDIO (C1.1 C25.1 U1.4 U3.4), DC POWER (C33.2 C34.1 F2.2 U6.2)
+12VHP: AUDIO (8 pins), DC POWER (F1.2), DIGITAL (R56.1)
-12V: AUDIO (C1.2 C25.2 U1.11 U3.11), DC POWER (C35.2 F3.2)
GND: Distribution Amp (44 pins), AUDIO (42 pins), DC POWER (6 pins), DIGITAL (30 pins)
+5V IN: Distribution Amp (J1.a26 J1.b26 J1.c26), DC POWER (F4.1)
+12V IN: Distribution Amp (6 pins), DC POWER (F1.1 F2.1)
-12V IN: Distribution Amp (J1.a31 J1.b31 J1.c31), DC POWER (F3.1)
INL_1: Distribution Amp (J1.c18), AUDIO (R3.1)
INL_1_GND: Distribution Amp (J1.c19), AUDIO (R49.1)
INL_2: Distribution Amp (J1.c21), AUDIO (R11.1)
INL_2_GND: Distribution Amp (J1.c20), AUDIO (R54.1)
INL_3: Distribution Amp (J1.c17), AUDIO (R23.1)
INL_3_GND: Distribution Amp (J1.c16), AUDIO (R57.1)
INL_4: Distribution Amp (J1.c22), AUDIO (R31.1)
INL_4_GND: Distribution Amp (J1.c23), AUDIO (R60.1)
INR_1: Distribution Amp (J1.a18), AUDIO (R7.1)
INR_1_GND: Distribution Amp (J1.a19), AUDIO (R50.1)
INR_2: Distribution Amp (J1.a21), AUDIO (R19.1)
INR_2_GND: Distribution Amp (J1.a20), AUDIO (R55.1)
INR_3: Distribution Amp (J1.a17), AUDIO (R27.1)
INR_3_GND: Distribution Amp (J1.a16), AUDIO (R58.1)
INR_4: Distribution Amp (J1.a22), AUDIO (R35.1)
INR_4_GND: Distribution Amp (J1.a23), AUDIO (R61.1)
LEFT_1+: Distribution Amp (J1.a5 J1.b5 J1.c5), AUDIO (U4.4)
LEFT_1-: Distribution Amp (J1.a4 J1.b4 J1.c4), AUDIO (U4.6)
LEFT_2+: Distribution Amp (J1.a15 J1.b15 J1.c15), AUDIO (U5.4)
LEFT_2-: Distribution Amp (J1.a14 J1.b14 J1.c14), AUDIO (U5.6)
MUTE: AUDIO (U2.12 U4.11 U5.11), DIGITAL (Q1.3 R56.2)
RIGHT_1+: Distribution Amp (J1.a3 J1.b3 J1.c3), AUDIO (U4.7)
RIGHT_1-: Distribution Amp (J1.a2 J1.b2 J1.c2), AUDIO (U4.9)
RIGHT_2+: Distribution Amp (J1.a13 J1.b13 J1.c13), AUDIO (U5.7)
RIGHT_2-: Distribution Amp (J1.a12 J1.b12 J1.c12), AUDIO (U5.9)
RX_MD: Distribution Amp (J1.c24), DIGITAL (R67.2)
SCL: AUDIO (U2.32), DIGITAL (P3.2 R69.2 U7.10 U8.22)
SDA: AUDIO (U2.1), DIGITAL (P3.1 R68.2 U7.7 U8.23)
TX_MD: Distribution Amp (J1.a24), DIGITAL (Q2.3)